# EAGLE schematic FinalSchem (EAGLE 9.3.0)
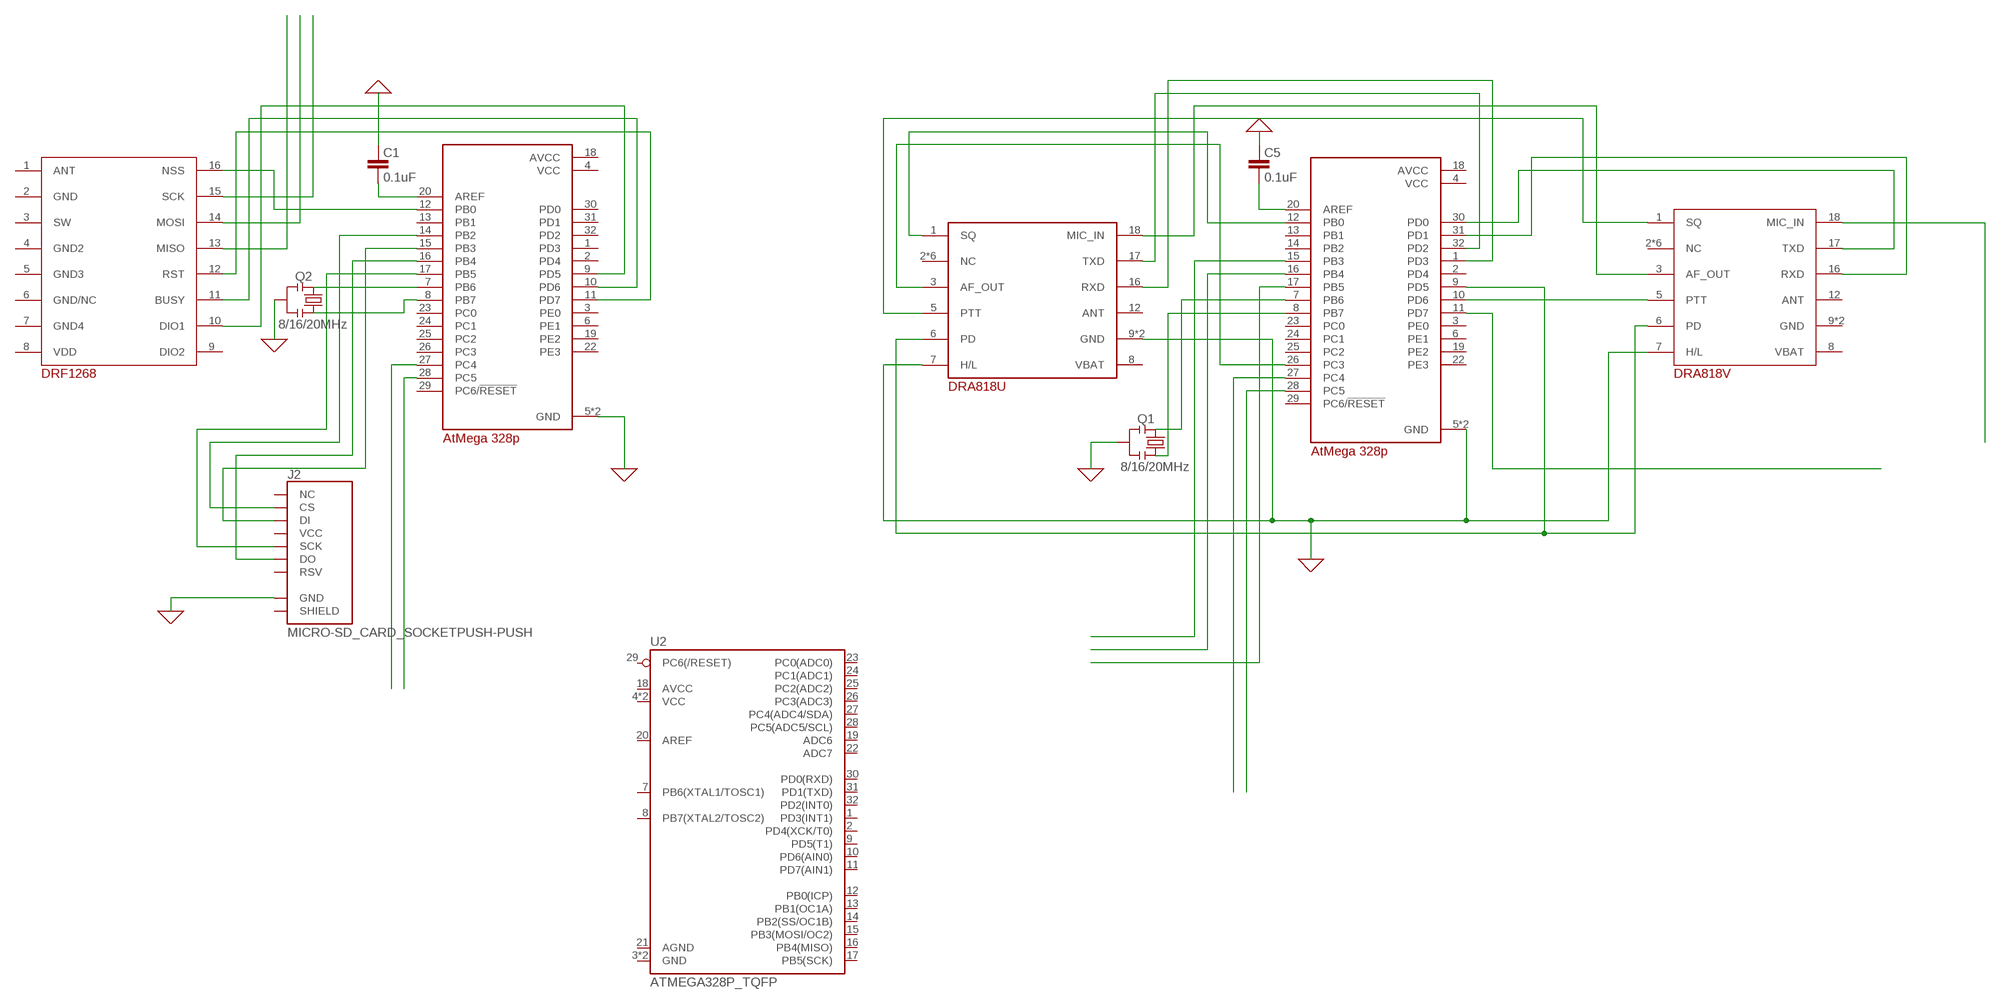
[diagram p0: schematic, sheet 1]

## Parts
C1  0.1uF  CAP0603-CAP  [0603-CAP]
C5  0.1uF  CAP0603-CAP  [0603-CAP]
J2  MICRO-SD_CARD_SOCKETPUSH-PUSH  [MICRO-SD-SOCKET]
Q1  8/16/20MHz  RESONATOR1:1  [RESONATOR-SMD-1:1]
Q2  8/16/20MHz  RESONATOR1:1  [RESONATOR-SMD-1:1]
U1  ATMEGA328PB-AUR  [QFP80P900X900X120-32N]
U2  ATMEGA328P_TQFP  [TQFP32-08]
U4  ATMEGA328PB-AUR  [QFP80P900X900X120-32N]
U$2  DRA818V  [DORJI_DRA818V]
U$3  DRA818U  [DORJI_DRA818U]
U$4  DRF1268  [RESCAV180P1570X1400X300-16]

## Nets
0: C1.2 C5.2 J2.GND Q2.2 U1.5(GND) U1.21(GND) U4.5(GND) U4.21(GND) U$2.7(H/L) U$3.7(H/L) U$3.9(GND) U$3.10(GND) ; supply symbol labelled GND
N$1: U$2.3(AF_OUT) U$3.18(MIC_IN)
N$2: U$2.1(SQ) U$3.5(PTT)
N$3: U1.12(PB0) U$3.1(SQ)
N$4: U1.26(PC3) U$3.3(AF_OUT)
N$5: J2.DI U4.15(PB3)
N$6: U1.9(PD5) U$2.6(PD) U$3.6(PD)
N$7: U1.31(PD1) U$2.16(RXD)
N$8: U1.30(PD0) U$2.17(TXD)
N$9: U$2.18(MIC_IN)
N$10: U1.11(PD7)
N$11: U1.10(PD6) U$2.5(PTT)
N$12: U1.15(PB3)
N$13: U1.27(PC4)
N$14: U1.28(PC5)
N$15: U1.16(PB4)
N$16: U1.17(PB5)
N$17: Q1.1 U1.7(PB6)
N$18: Q1.3 U1.8(PB7)
N$19: Q1.2 ; supply symbol labelled GND
N$20: C5.1 U1.20(AREF)
N$21: U1.32(PD2) U$3.17(TXD)
N$22: U1.1(PD3) U$3.16(RXD)
N$23: U$4.13(MISO)
N$24: U$4.14(MOSI)
N$25: U$4.15(SCK)
N$26: Q2.1 U4.7(PB6)
N$27: Q2.3 U4.8(PB7)
N$28: C1.1 U4.20(AREF)
N$30: U4.27(PC4)
N$31: U4.28(PC5)
N$58: J2.DO U4.16(PB4)
N$59: J2.CS U4.14(PB2)
N$60: J2.SCLK(SCK) U4.17(PB5)
N$61: U4.9(PD5) U$4.10(DIO1)
N$62: U4.12(PB0) U$4.16(NSS)
N$63: U4.11(PD7) U$4.12(RST)
N$64: U4.10(PD6) U$4.11(BUSY)
Unconnected: J2.CD1(SHIELD) J2.RSV1(RSV) J2.RSV2(NC) J2.VCC U1.2(PD4) U1.3(PE0) U1.6(PE1) U1.13(PB1) U1.14(PB2) U1.19(PE2) U1.22(PE3) U1.23(PC0) U1.24(PC1) U1.25(PC2) U1.29(PC6/!RESET) U2.1(PD3(INT1)) U2.2(PD4(XCK/T0)) U2.3(GND) U2.4(VCC) U2.5(GND) U2.6(VCC) U2.7(PB6(XTAL1/TOSC1)) U2.8(PB7(XTAL2/TOSC2)) U2.9(PD5(T1)) U2.10(PD6(AIN0)) U2.11(PD7(AIN1)) U2.12(PB0(ICP)) U2.13(PB1(OC1A)) U2.14(PB2(SS/OC1B)) U2.15(PB3(MOSI/OC2)) U2.16(PB4(MISO)) U2.17(PB5(SCK)) U2.18(AVCC) U2.19(ADC6) U2.20(AREF) U2.21(AGND) U2.22(ADC7) U2.23(PC0(ADC0)) U2.24(PC1(ADC1)) U2.25(PC2(ADC2)) U2.26(PC3(ADC3)) U2.27(PC4(ADC4/SDA)) U2.28(PC5(ADC5/SCL)) U2.29(PC6(/RESET)) U2.30(PD0(RXD)) U2.31(PD1(TXD)) U2.32(PD2(INT0)) U4.1(PD3) U4.2(PD4) U4.3(PE0) U4.6(PE1) U4.13(PB1) U4.19(PE2) U4.22(PE3) U4.23(PC0) U4.24(PC1) U4.25(PC2) U4.26(PC3) U4.29(PC6/!RESET) U4.30(PD0) U4.31(PD1) U4.32(PD2) U$2.2(NC) U$2.4(NC) U$2.8(VBAT) U$2.9(GND) U$2.10(GND) U$2.11(NC) U$2.12(ANT) U$2.13(NC) U$2.14(NC) U$2.15(NC) U$3.2(NC) U$3.4(NC) U$3.8(VBAT) U$3.11(NC) U$3.12(ANT) U$3.13(NC) U$3.14(NC) U$3.15(NC) U$4.1(ANT) U$4.2(GND) U$4.3(SW) U$4.4(GND2) U$4.5(GND3) U$4.6(GND/NC) U$4.7(GND4) U$4.8(VDD) U$4.9(DIO2)

## Power pins joined to a net without a drawn wire
AVCC: U1.18(AVCC) U4.18(AVCC)
VCC: U1.4(VCC) U4.4(VCC)

## Library data of the parts
C1 C5 = SparkFun:CAP: Capacitor Standard 0603 ceramic capacitor, and 0.1" leaded capacitor.
J2 = SparkFun-Connectors:MICRO-SD_CARD_SOCKET: microSD Socket for Transflash Push-push type µSD socket. tDoc lines correctly indicate media card edge positions when inserting (unlocked, locked, depressed). NOTE: CD1 and CD2 are connected internally, and the default detect state of the socket is detect pin to ground. SparkFun Products: WAV Trigger <https://www.sparkfun.com/products/13660> CAN-Bus Shield <https://www.sparkfun.com/products/13262> SparkFun Level Shifing microSD Breakout <https://www.sparkfun.com/products/13743>; PROD_ID: CONN-07820
Q1 Q2 = Testing:RESONATOR: Resonator Small SMD resonator. This is the itty bitty 10/20MHz resonators with built in caps. CSTCE10M0G55 and CSTCE20M0V53. Footprint for SMD has been used in SFE production for years, and does work okay. 1:1 is an attempt to get larger fillets on the sides so it will be easier to inspect these solders in our AOI machine. The pads have been minimized to match the actual metal under the resonator. To see this relation, it includes an image import of the bottom side of the component. Imported to scale on layer 200.
U1 U4 = ATMEGA328PB-AUR:ATMEGA328PB-AUR: ATmega Series 20 MHz 32 KB Flash 2 KB SRAM 8-Bit Microcontroller - TQFP-32; AVAILABILITY: Unavailable; DESCRIPTION: AVR microcontroller; EEPROM: 1024B; SRAM: 2kB; Flash: 32kB; TQFP32; MF: Microchip; MP: ATMEGA328PB-AUR; PACKAGE: TQFP-32 Microchip; PRICE: None
U2 = SparkFun-IC-Microcontroller:ATMEGA328P_TQFP: Popular 328P in QFP Storefront component: ATmega328 - TQFP <https://www.sparkfun.com/products/13448> (COM-13448) Datasheet <http://www.sparkfun.com/datasheets/Components/SMD/ATMega328.pdf> SparkFun Products SparkFun RedBoard - Programmed with Arduino <https://www.sparkfun.com/products/12757> (DEV-12757) Arduino Pro Mini 328 - 5V/16MHz <https://www.sparkfun.com/products/11113> (DEV-11113) Arduino Pro Mini 328 - 3.3V/8MHz <https://www.sparkfun.com/products/11114> (DEV-11114) SparkFun OpenLog <https://www.sparkfun.com/products/13712> (DEV-13712) SparkFun MicroView - OLED Arduino Module <https://www.sparkfun.com/products/12923> (DEV-12923) SparkFun Digital Sandbox <https://www.sparkfun.com/products/12651> (DEV-12651) SparkFun PicoBoard <https://www.sparkfun.com/products/11888> (WIG-11888) Arduino Fio <https://www.sparkfun.com/products/10116> (DEV-10116) LilyPad Arduino 328 Main Board <https://www.sparkfun.com/products/13342> (DEV-13342) SparkFun RedStick <https://www.sparkfun.com/products/13741> (DEV-13741) LilyPad MP3 <https://www.sparkfun.com/products/11013> (DEV-11013) LilyPad Arduino SimpleSnap <https://www.sparkfun.com/products/10941> (DEV-10941) SparkFun Stepoko <https://www.sparkfun.com/products/13899> (ROB-13899) SparkFun Geiger Counter <https://www.sparkfun.com/products/11345> (SEN-11345) SparkFun EL Sequencer <https://www.sparkfun.com/products/12781> (COM-12781) Arduino Pro 328 - 5V/16MHz <https://www.sparkfun.com/products/10915> (DEV-10915) CryptoCape <https://www.sparkfun.com/products/12773> (DEV-12773) SparkFun IR Thermometer Evaluation Board - MLX90614 <https://www.sparkfun.com/products/10740> (SEN-10740) SparkFun RedBot Mainboard <https://www.sparkfun.com/products/12097> (ROB-12097) Arduino Pro 328 - 3.3V/8MHz <https://www.sparkfun.com/products/10914> (DEV-10914) SparkFun Block for Intel® Edison - Arduino <https://www.sparkfun.com/products/13036> (DEV-13036) SparkFun Simon Says - Surface Mount Soldering Kit <https://www.sparkfun.com/products/10935> (KIT-10935) SparkFun 7-Segment Serial Display - Red <https://www.sparkfun.com/products/11441> (COM-11441) SparkFun 7-Segment Serial Display - White <https://www.sparkfun.com/products/11629> (COM-11629) SparkFun 7-Segment Serial Display - Yellow <https://www.sparkfun.com/products/11443> (COM-11443) SparkFun 7-Segment Serial Display - Kelly Green <https://www.sparkfun.com/products/11440> (COM-11440) SparkFun 7-Segment Serial Display - Blue <https://www.sparkfun.com/products/11442> (COM-11442) SparkFun OpenSegment Serial Display - 20mm (Blue) <https://www.sparkfun.com/products/11647> (COM-11647) SparkFun OpenSegment Serial Display - 20mm (Green) <https://www.sparkfun.com/products/11646> (COM-11646) SparkFun OpenSegment Serial Display - 20mm (White) <https://www.sparkfun.com/products/11648> (COM-11648) SparkFun OpenSegment Serial Display - 20mm (Red) <https://www.sparkfun.com/products/11644> (COM-11644) SparkFun OpenSegment Serial Display - 20mm (Yellow) <https://www.sparkfun.com/products/11645> (COM-11645) SparkFun OpenSegment Shield <https://www.sparkfun.com/products/13190> (DEV-13190); PROD_ID: IC-09069
U$2 = DRA818V:DRA818V
U$3 = DRA818U:DRA818U
U$4 = DRF1268:DRF1268